# EasyEDA Pro project ProProject_节拍器（EDA专业版导入)_2023-12-29_2024-01-28.epro

# Schematic 节拍器
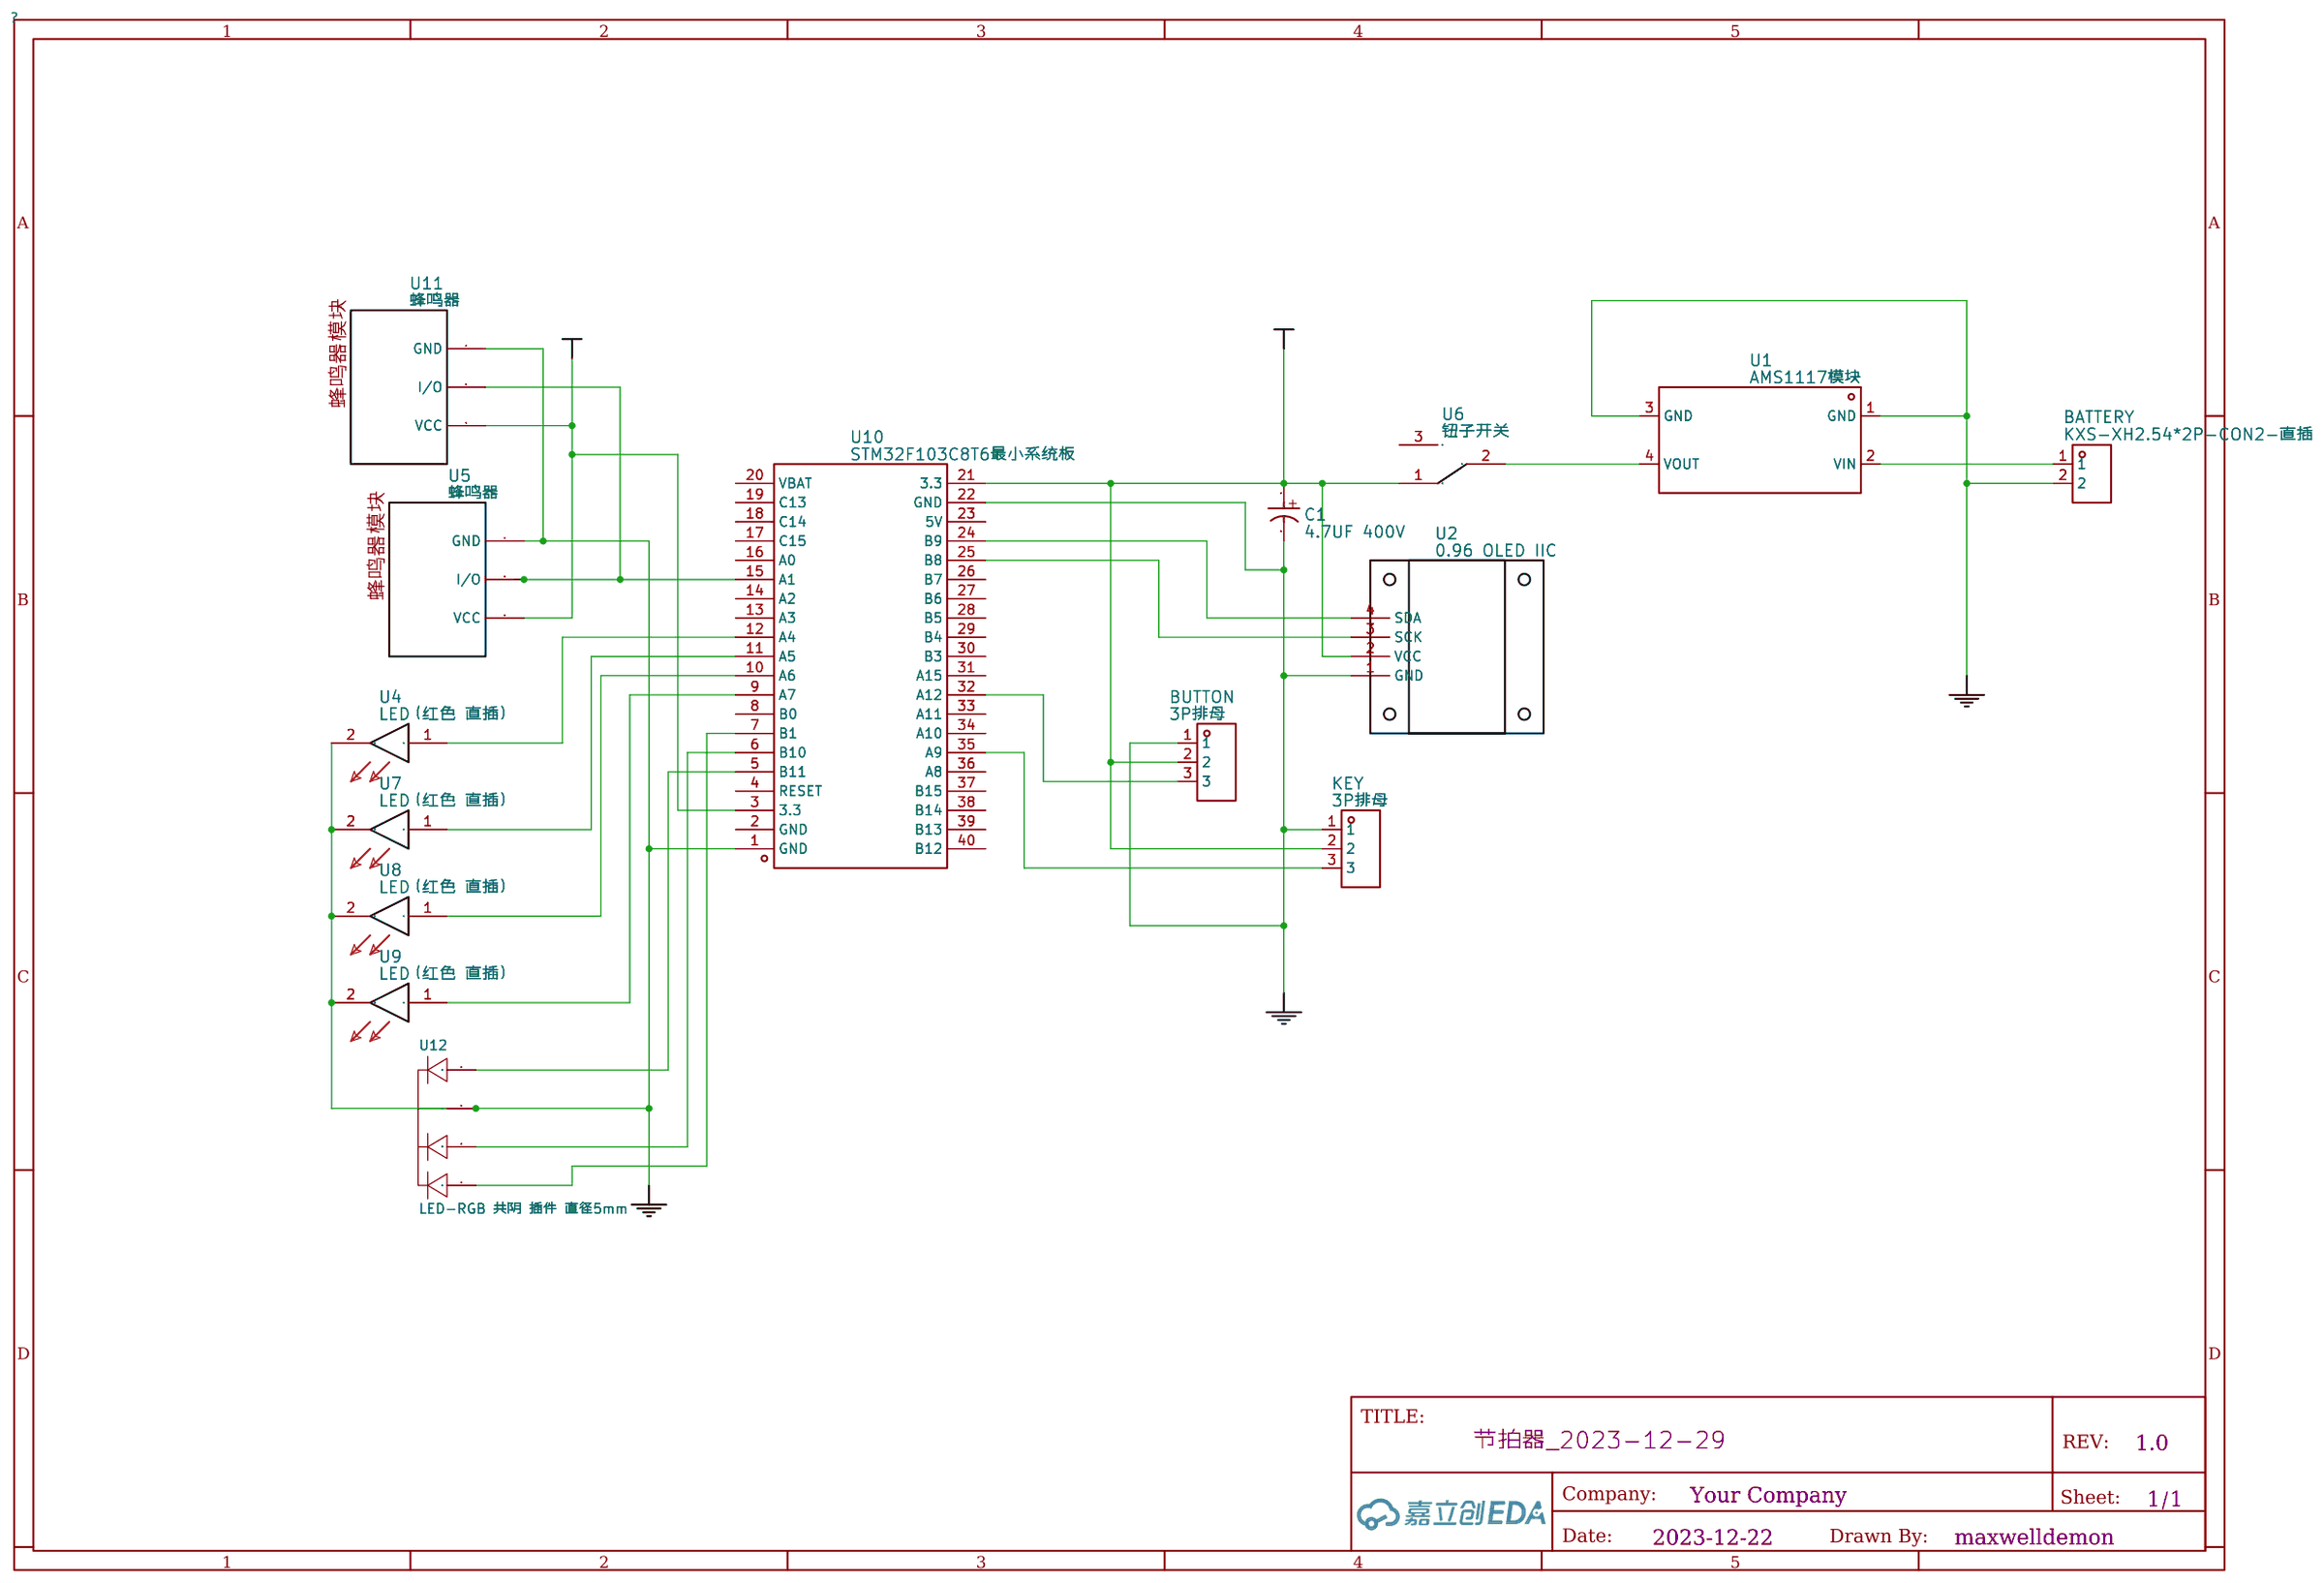
[diagram p0: schematic sheet]

## Parts
BATTERY  KXS-XH2.54*2P-CON2-直插  [KXS-XH2.54-CONN-TH_XH2.54-2P]
BUTTON  3P排母  [3P排母]
C1  4.7UF 400V  [6X12]
KEY  3P排母  [3P排母]
U1  AMS1117模块  [_AMS1117模块]
U2  0.96 OLED IIC  [0.96寸OLED模块I2C]
U4  LED（红色 直插）  [LED直插]
U5  蜂鸣器  [蜂鸣器模块]
U6  钮子开关  [钮子开关钮子开关三脚三档]
U7  LED（红色 直插）  [LED直插]
U8  LED（红色 直插）  [LED直插]
U9  LED（红色 直插）  [LED直插]
U10  STM32F103C8T6最小系统板  [STM32F103C8T6最小系统板PCB图]
U11  蜂鸣器  [蜂鸣器模块]
U12  LED-RGB 共阴 插件 直径5mm  [LED-TH_4P-BD5.8-P1.30]

## Library data of the parts
BATTERY = KXS-XH2.54*2P-CON2-直插: link: https://img.jlc.com/image//data/smt-stock-produce/componentSizePhoto/2022-02-28/c2f8e9bd088f450e835ab7232f25cd7f/BG2202260018_D22021900064_font.png; 3DModel: CONN-TH_XH2.54-2P_C9900008764; Supplier: LCSC; Supplier Part: C9900008615; Manufacturer: null; Manufacturer Part: KXS-XH2.54*2P_直插; JLCPCB Part Class: Extended Part
BUTTON KEY = 3P排母: Supplier: LCSC; Supplier Part: C2758343
C1 = 4.7UF 400V
U1 = AMS1117模块
U2 = 0.96 OLED IIC: Manufacturer Part: 0.96 OLED
U4 U7-U9 = LED（红色 直插）
U5 U11 = 蜂鸣器
U6 = 钮子开关
U10 = STM32F103C8T6最小系统板: Supplier: LCSC
U12 = LED-RGB 共阴 插件 直径5mm: Supplier Part: C9900015469; Supplier Footprint: LED_RGB; JLCPCB Part Class: 扩展库; Datasheet: https://atta.szlcsc.comnull; Supplier: LCSC

## Nets
GND: BATTERY.2 BUTTON.1 C1.2 KEY.1 U1.1(GND) U1.3(GND) U2.1(GND) U4.2 U5.1(GND) U7.2 U8.2 U9.2 U10.1(GND) U10.22(GND) U11.1(GND) U12.2(-)
VCC: BUTTON.2 C1.1 KEY.2 U2.2(VCC) U5.3(VCC) U6.1(3) U10.3(3.3) U10.21(3.3) U11.3(VCC)
$1N172: U2.4(SDA) U10.24(B9)
$1N173: U2.3(SCK) U10.25(B8)
$1N182: U4.1 U10.12(A4)
$1N183: U7.1 U10.11(A5)
$1N184: U8.1 U10.10(A6)
$1N185: U9.1 U10.9(A7)
$1N219: KEY.3 U10.35(A9)
$1N256: BATTERY.1 U1.2(VIN)
$1N257: U1.4(VOUT) U6.2(1)
$1N621: BUTTON.3 U10.32(A12)
$1N675: U5.2(I/O) U10.15(A1) U11.2(I/O)
$1N1085: U10.5(B11) U12.1
$1N1093: U10.6(B10) U12.3
$1N1110: U10.7(B1) U12.4

Not connected (* = marked no-connect by the designer): U6 3(4); U10 2(GND) 4(RESET) 8(B0) 13(A3) 14(A2) 16(A0) 17(C15) 18(C14) 19(C13) 20(VBAT) 23(5V) 26(B7) 27(B6) 28(B5) 29(B4) 30(B3) 31(A15) 33(A11) 34(A10) 36(A8) 37(B15) 38(B14) 39(B13) 40(B12)

# Board PCB_PCB_节拍器_3_2023-12-29
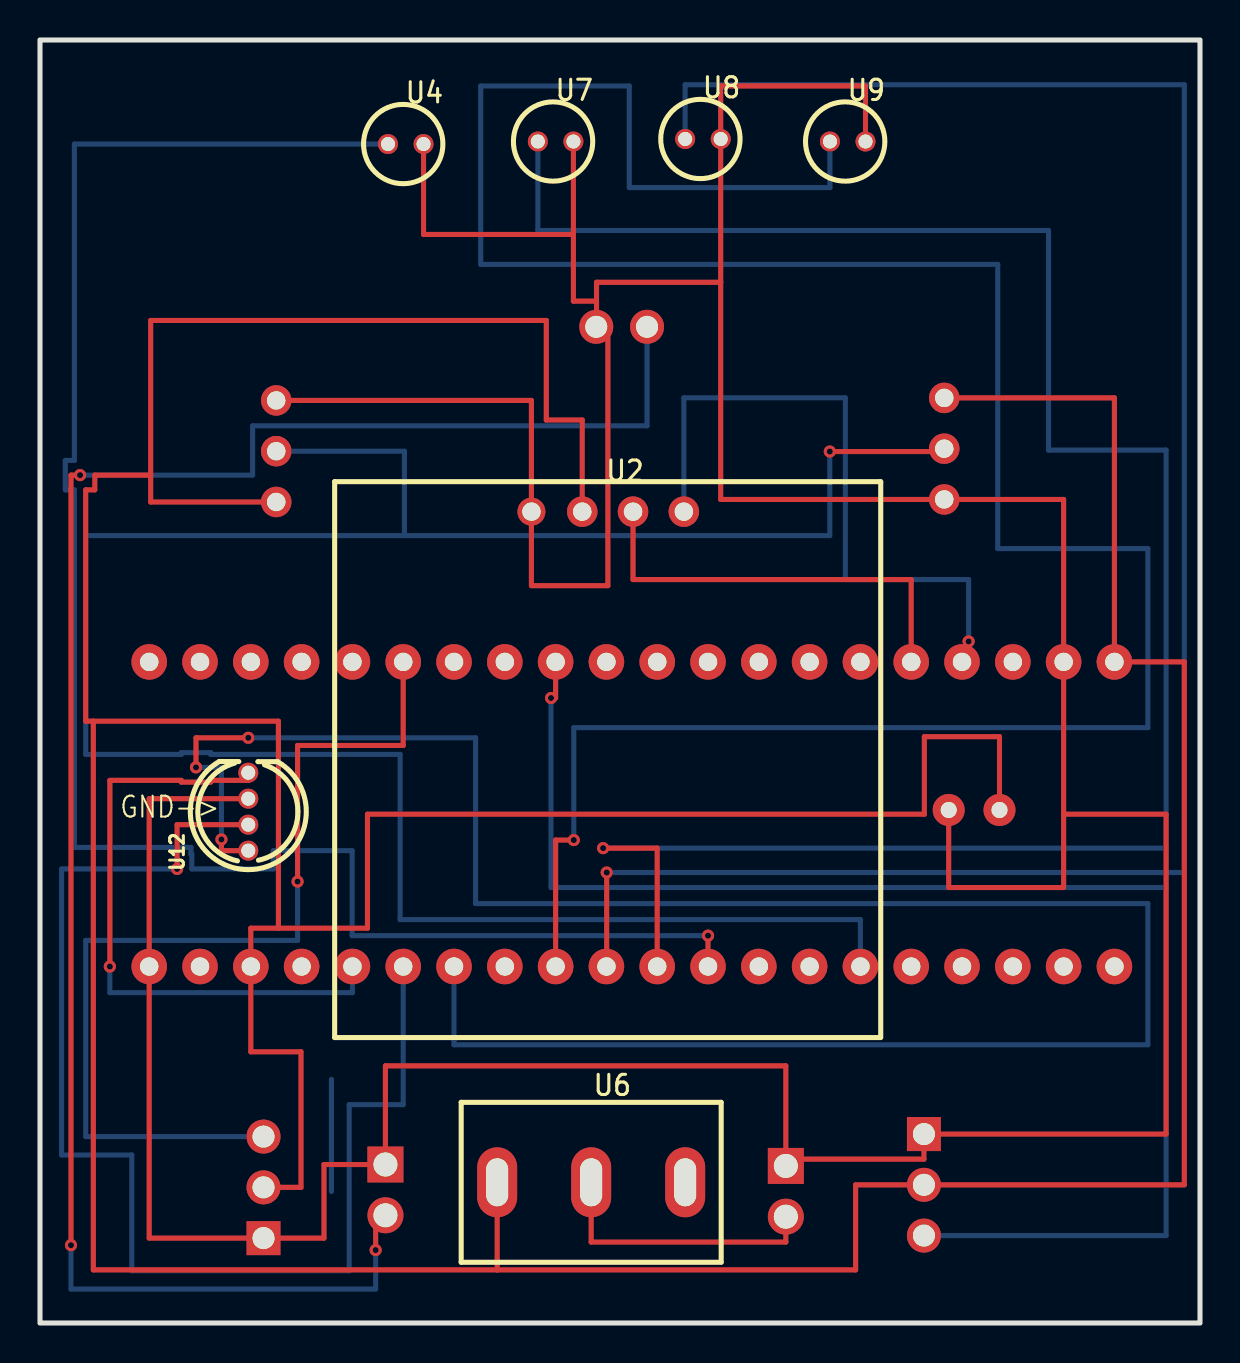
[diagram p1: board, top side]
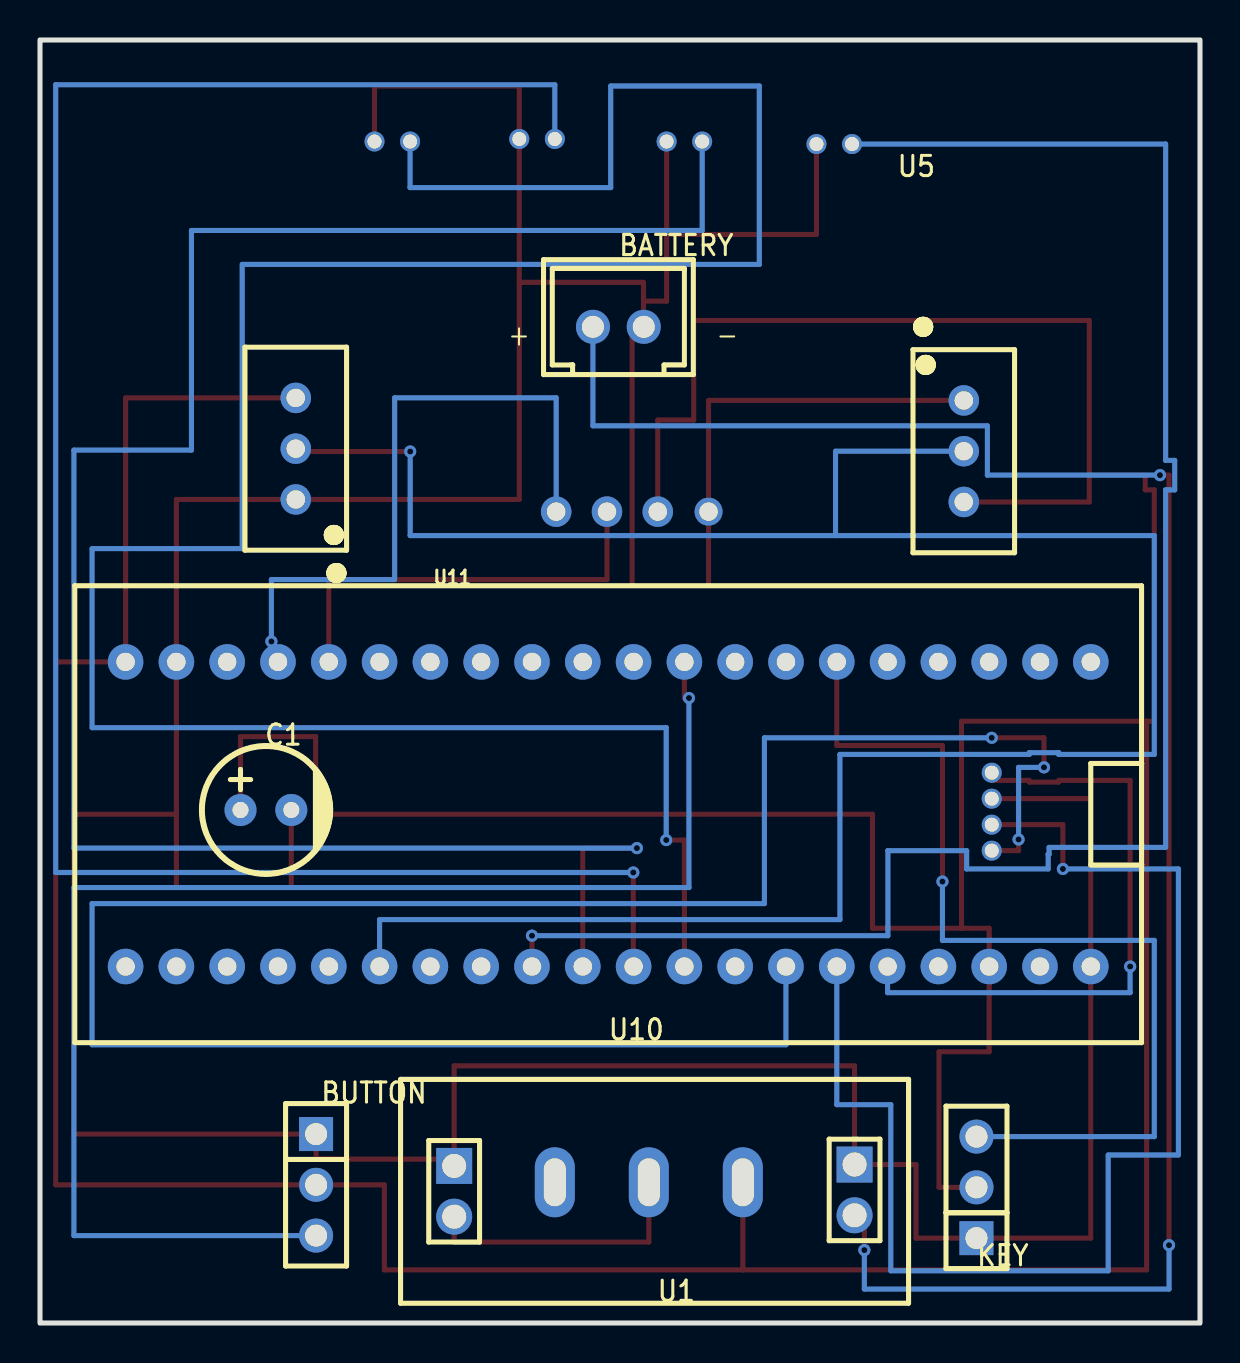
[diagram p2: board, bottom side, seen from below]

Outline 58 x 64.19 mm; copper layers: Top Layer, Bottom Layer. Coordinates in mm from the lower left corner of the outline.
Outline path: rectangle 0,64.19 58,0
Stack: Top Layer 0.035mm / Dielectric1 1.51mm FR4 er 4.5 / Bottom Layer 0.035mm

## Design rules (mm)
spacing Default (default): track to track 0.152, other pairs 0 to 0.152
track width Default (default): min 0.254, default 0.254, max 25.4
differential pair differentialPair (default): width min 0.127, default 0.254, max 2.54; gap min 0.152, default 0.152
via Default (default): diameter min 0.61, default 0.61, max 100.025; hole min 0.305, default 0.305, max 59.995

## Placement (name value [footprint] x y rotation side)
BATTERY  KXS-XH2.54*2P-CON2-直插  [KXS-XH2.54-CONN-TH_XH2.54-2P]  29.08 49.84 180 bottom
BUTTON  -  [3P排母]  44.2 6.91 180 bottom
C1  4.7UF 400V  [6X12]  46.36 24.57 180 bottom
KEY  -  [3P排母]  11.18 6.79 0 bottom
U1  AMS1117模块  [_AMS1117模块]  27.69 6.79 0 bottom
U2  0.96 OLED IIC  [0.96寸OLED模块I2C]  14.73 42.09 0 top
U4  LED（红色 直插）  [LED直插]  18.16 58.98 0 top
U5  蜂鸣器  [蜂鸣器模块]  11.81 43.62 180 bottom
U6  钮子开关  [钮子开关钮子开关三脚三档]  27.56 7.04 0 top
U7  LED（红色 直插）  [LED直插]  25.65 59.11 0 top
U8  LED（红色 直插）  [LED直插]  33.02 59.24 0 top
U9  LED（红色 直插）  [LED直插]  40.26 59.11 0 top
U10  STM32F103C8T6最小系统板  [STM32F103C8T6最小系统板PCB图]  20.7 33.08 0 bottom
U11  蜂鸣器  [蜂鸣器模块]  45.21 43.74 0 bottom
U12  LED-RGB 共阴 插件 直径5mm  [LED-TH_4P-BD5.8-P1.30]  10.41 25.58 90 top

## Footprints (pads in the part's own frame, mm; a bottom-side part is the same pattern mirrored in y, then rotated)
0.96寸OLED模块I2C
  round 1.4 hole 0.919x0.914: 1(9.84,-1.5)
  round 1.524 hole 0.919x0.914: 2(12.38,-1.5) 3(14.92,-1.5) 4(17.46,-1.5)
3P排母
  rect 1.7x1.7 hole 1.1: 1(0,2.54)
  round 1.7 hole 1.1: 2(0,0) 3(0,-2.54)
6X12
  round 1.6 hole 0.8: 1(-1.62,1.1) 2(0.92,1.1)
_AMS1117模块
  rect 1.8x1.8 hole 1.2: 1(-10.414,-1.143) 3(9.606,-1.073)
  round 1.8 hole 1.2: 2(-10.414,1.397) 4(9.606,1.467)
KXS-XH2.54-CONN-TH_XH2.54-2P
  round 1.7 hole 1.1: 1(-1.27,0) 2(1.27,0)
LED-TH_4P-BD5.8-P1.30
  round 1 hole 0.7: 1(1.95,0) 2(0.65,0) 3(-0.65,0) 4(-1.95,0)
LED直插
  round 1 hole 0.7: 1(-0.762,0) 2(1.016,0)
STM32F103C8T6最小系统板PCB图
  round 1.778 hole 0.919x0.914: 1(-15.24,15.24) 2(-12.7,15.24) 3(-10.16,15.24) 4(-7.62,15.24) 5(-5.08,15.24) 6(-2.54,15.24) 7(0,15.24) 8(2.54,15.24) 9(5.08,15.24) 10(7.62,15.24) 11(10.16,15.24) 12(12.7,15.24) 13(15.24,15.24) 14(17.78,15.24) 15(20.32,15.24) 16(22.86,15.24) 17(25.4,15.24) 18(27.94,15.24) 19(30.48,15.24) 20(33.02,15.24) 21(33.02,0) 22(30.48,0) 23(27.94,0) 24(25.4,0) 25(22.86,0) 26(20.32,0) 27(17.78,0) 28(15.24,0) 29(12.7,0) 30(10.16,0) 31(7.62,0) 32(5.08,0) 33(2.54,0) 34(0,0) 35(-2.54,0) 36(-5.08,0) 37(-7.62,0) 38(-10.16,0) 39(-12.7,0) 40(-15.24,0)
蜂鸣器模块
  round 1.524 hole 0.919x0.914: 1(0,2.54) 2(0,0) 3(0,-2.54)
钮子开关钮子开关三脚三档
  oval 2x3.5 hole 1.1x2.4: 1(-4.7,0) 2(0,0) 3(4.7,0)

## Nets
As in the schematic.

Pads without a net: U6 3; U10 2 4 8 13 14 16 17 18 19 20 23 26 27 28 29 30 31 33 34 36 37 38 39 40

## Via types
v1: diameter 0.61, hole 0.305, Top Layer to Bottom Layer, 16 vias

## Routing (per net, layer and track width the routed paths; a pad name or vN(x,y) marks a point on that pad's centre or on a via; arc(x,y) is an arc through that point)
GND: length 259.7
  Top Layer w0.254: U1.3 37.29,8.2 ; 37.29,8.2 44.2,8.2 BUTTON.1 56.3,9.45 56.3,25.46 51.18,25.46 ; 37.29,8.2 37.29,12.87 17.27,12.87 U1.1 14.2,7.93 14.2,4.25 KEY.1 5.46,4.25 U10.1 5.46,26.23 U12.2 ; 34.04,52.07 27.83,52.07 27.83,51.12 ; 34.04,52.07 34.04,41.2 51.18,41.2 U10.22 51.18,25.46 ; 34.04,52.07 U8.2 34.04,61.89 41.28,61.89 41.28,59.11 ; 26.67,54.46 26.67,51.12 27.83,51.12 ; 26.67,54.46 U7.2 ; 26.67,54.46 19.18,54.46 U4.2 ; 51.18,25.46 51.18,21.79 45.44,21.79 C1.2 ; 27.83,51.12 27.83,49.84 ; 27.83,49.84 28.39,49.84 28.39,36.89 24.57,36.89 U2.1 24.57,46.16 U5.1 ; 27.83,49.84 BATTERY.2
VCC: length 292.1
  Top Layer w0.254: U11.3 53.72,46.28 U10.21 57.22,33.08 57.22,6.91 BUTTON.2 40.78,6.91 40.78,2.66 22.86,2.66 ; 22.86,2.66 2.67,2.66 2.67,30.11 ; 22.86,2.66 U6.1 ; 2.67,30.11 11.92,30.11 11.92,19.75 ; 2.67,30.11 2.29,30.11 2.29,41.68 2.74,41.68 2.74,42.42 5.54,42.42 ; U2.2 27.11,45.18 25.32,45.18 25.32,50.16 5.54,50.16 5.54,42.42 ; 11.92,19.75 16.37,19.75 16.37,25.46 44.22,25.46 44.22,29.34 47.98,29.34 C1.1 ; 11.92,19.75 10.54,19.75 U10.3 10.54,13.57 13.05,13.57 13.05,6.79 KEY.2 ; 5.54,42.42 5.54,41.08 U5.3
$1N172: length 33.5
  Top Layer w0.254: U10.24 46.43,33.08 v1(46.43,34.1)
  Bottom Layer w0.254: U2.4 32.19,46.29 40.27,46.29 40.27,37.19 46.43,37.19 v1(46.43,34.1)
$1N173: length 21.4
  Top Layer w0.254: U2.3 29.65,37.19 43.56,37.19 U10.25
$1N182: length 91.2
  Top Layer w0.254: v1(33.4,19.38) U10.12
  Bottom Layer w0.254: v1(33.4,19.38) 15.61,19.38 15.61,23.63 11.67,23.63 11.67,22.72 7.59,22.72 7.59,23.45 7.55,23.45 7.55,23.8 1.72,23.8 1.72,41.68 1.27,41.68 1.27,43.16 1.72,43.16 1.72,58.98 U4.1
$1N183: length 103.5
  Top Layer w0.254: U10.11 30.86,23.76 v1(28.16,23.76)
  Bottom Layer w0.254: U7.1 24.89,54.66 50.43,54.66 50.43,43.67 56.3,43.67 56.3,23.76 v1(28.16,23.76)
$1N184: length 100.7
  Top Layer w0.254: v1(28.34,22.54) 28.34,17.84 U10.10
  Bottom Layer w0.254: v1(28.34,22.54) 57.22,22.54 57.22,61.95 32.26,61.95 U8.1
$1N185: length 131.9
  Top Layer w0.254: U10.9 25.78,24.16 v1(26.69,24.16)
  Bottom Layer w0.254: U9.1 39.5,56.81 29.46,56.81 29.46,61.89 22.03,61.89 22.03,52.96 47.89,52.96 47.89,38.74 55.39,38.74 55.39,29.79 26.69,29.79 v1(26.69,24.16)
$1N219: length 48.5
  Top Layer w0.254: U10.35 18.16,28.9 12.88,28.9 v1(12.88,22.09)
  Bottom Layer w0.254: KEY.3 2.29,9.33 2.29,19.14 12.88,19.14 v1(12.88,22.09)
$1N256: length 96.4
  Top Layer w0.254: v1(2,42.42) 1.55,42.42 v1(1.55,3.89) ; v1(16.78,3.65) 16.78,5.39 U1.2
  Bottom Layer w0.254: 30.35,49.84 30.35,44.89 10.63,44.89 10.63,42.42 v1(2,42.42) ; v1(1.55,3.89) 1.55,1.7 16.78,1.7 v1(16.78,3.65)
$1N257: length 14
  Top Layer w0.254: U6.2 27.56,4.05 37.29,4.05 37.29,5.32
$1N621: length 71.8
  Top Layer w0.254: v1(25.55,31.27) 25.78,31.27 U10.32
  Bottom Layer w0.254: BUTTON.3 56.3,4.37 56.3,21.79 25.55,21.79 v1(25.55,31.27)
$1N675: length 118.4
  Top Layer w0.254: v1(39.49,43.6) 45.21,43.6 U11.2
  Bottom Layer w0.254: U5.2 18.22,43.62 18.22,39.4 ; U10.15 41.02,20.18 18,20.18 18,28.45 8.54,28.45 8.54,28.54 7.06,28.54 7.06,28.45 2.29,28.45 2.29,39.4 18.22,39.4 ; 18.22,39.4 39.49,39.4 v1(39.49,43.6)
$1N1085: length 31.5
  Top Layer w0.254: U12.1 10.41,27.15 8.54,27.15 8.54,27.06 7.06,27.06 7.06,27.15 3.49,27.15 v1(3.49,17.84)
  Bottom Layer w0.254: U10.5 15.62,16.53 3.49,16.53 v1(3.49,17.84)
$1N1093: length 64
  Top Layer w0.254: v1(6.85,22.72) 6.85,24.93 U12.3
  Bottom Layer w0.254: v1(6.85,22.72) 1.08,22.72 1.08,8.41 4.59,8.41 4.59,2.61 15.46,2.61 15.46,10.93 18.16,10.93 U10.6
$1N1110: length 109.8
  Top Layer w0.254: v1(9.07,24.19) 9.07,23.63 U12.4 ; v1(10.41,29.28) 7.8,29.28 v1(7.8,27.8)
  Bottom Layer w0.254: v1(9.07,24.19) 9.07,27.8 v1(7.8,27.8) ; v1(10.41,29.28) 21.78,29.28 21.78,20.98 55.39,20.98 55.39,13.92 20.7,13.92 U10.7

## Copper pours and planes (outline as drawn; the poured copper is in the pictures)
GND on Top Layer: -6.22,65.21 64.64,65.21 64.64,-1.59 -6.22,-1.59
GND on Bottom Layer: -1.4,66.86 59.31,66.86 59.31,-1.98 -1.4,-1.98

## Text on the board
Bottom Silkscreen Layer: - | +
Top Silkscreen Layer: GND->
